# Altium schematic sheet Ch_VC.schdoc
size 403 x 215 mm
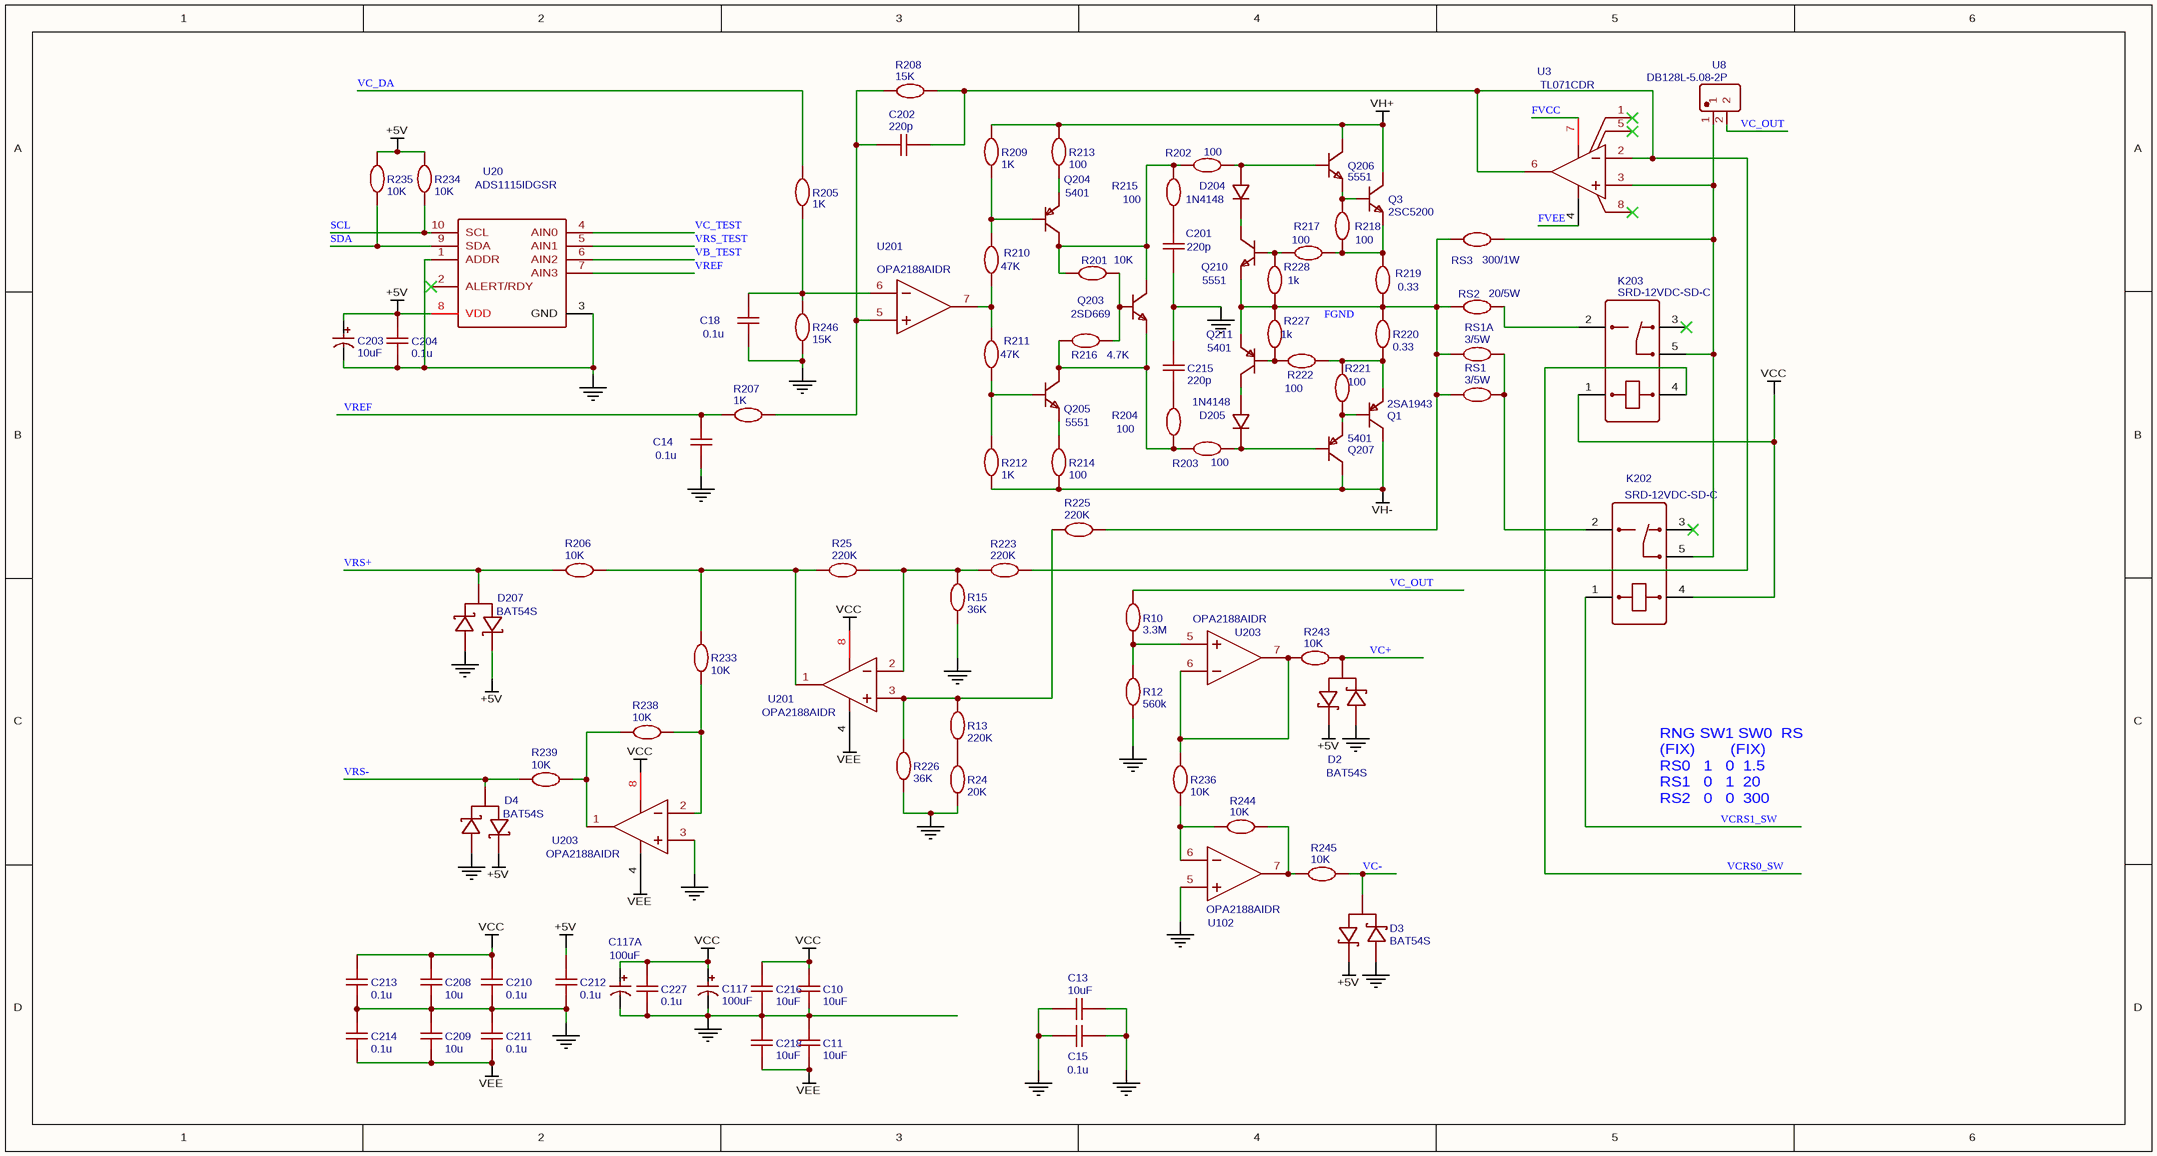
[diagram p0: Ch_VC.schdoc]

## Parts
(Parts that share a designator on the sheet are numbered #1, #2 ... from top to bottom, then left to right.)
C10  10uF  [C0805]
C11  10uF  [C0805]
C13  10uF  [C0805]
C14  0.1u  [C0805]
C15  0.1u  [C0805]
C18  0.1u  [C0805]
C117  100uF  [CAP-TH_BD8.0-P3.50-D1.0-FD]
C117A  100uF  [CAP-TH_BD8.0-P2.50-D1.0-FD]
C201  220p  [C0805]
C202  220p  [C0805]
C203  10uF  [C0805]
C204  0.1u  [C0805]
C208  10u  [C0805]
C209  10u  [C0805]
C210  0.1u  [C0805]
C211  0.1u  [C0805]
C212  0.1u  [C0805]
C213  0.1u  [C0805]
C214  0.1u  [C0805]
C215  220p  [C0805]
C216  10uF  [C0805]
C218  10uF  [C0805]
C227  0.1u  [C0805]
D2  BAT54S  [SOT-23(SOT-23-3)]
D3  BAT54S  [SOT-23(SOT-23-3)]
D4  BAT54S  [SOT-23(SOT-23-3)]
D204  1N4148  [SOD-123_L2.8-W1.8-LS3.7-RD]
D205  1N4148  [SOD-123_L2.8-W1.8-LS3.7-RD]
D207  BAT54S  [SOT-23(SOT-23-3)]
K202  SRD-12VDC-SD-C  [RELAY-SL-SRD]
K203  SRD-12VDC-SD-C  [RELAY-SL-SRD]
Q1  2SA1943  [TO-3PL_L20.0-W5.0-P5.45-L]
Q3  2SC5200  [TO-3PL_L20.0-W5.0-P5.45-L]
Q203  2SD669  [KO_TO126-ECB-V]
Q204  5401  [SOT-23-3_L2.9-W1.3-P1.90-LS2.4-BR]
Q205  5551  [SOT-23-3_L2.9-W1.3-P1.90-LS2.4-BR]
Q206  5551  [SOT-23-3_L2.9-W1.3-P1.90-LS2.4-BR]
Q207  5401  [SOT-23-3_L2.9-W1.3-P1.90-LS2.4-BR]
Q210  5551  [SOT-23-3_L2.9-W1.3-P1.90-LS2.4-BR]
Q211  5401  [SOT-23-3_L2.9-W1.3-P1.90-LS2.4-BR]
R10  3.3M  [R0805]
R12  560k  [R0805]
R13  220K  [R0805]
R15  36K  [R0805]
R24  20K  [R0805]
R25  220K  [R0805]
R201  10K  [R0805]
R202  100  [R0805]
R203  100  [R0805]
R204  100  [R0805]
R205  1K  [R0805]
R206  10K  [R0805]
R207  1K  [R0805]
R208  15K  [R0805]
R209  1K  [R0805]
R210  47K  [R0805]
R211  47K  [R0805]
R212  1K  [R0805]
R213  100  [R0805]
R214  100  [R0805]
R215  100  [R0805]
R216  4.7K  [R0805]
R217  100  [R0805]
R218  100  [R0805]
R219  0.33  [R-AXIAL-1.2- 5W]
R220  0.33  [R-AXIAL-1.2- 5W]
R221  100  [R0805]
R222  100  [R0805]
R223  220K  [R0805]
R225  220K  [R0805]
R226  36K  [R0805]
R227  1k  [R0805]
R228  1k  [R0805]
R233  10K  [R0805]
R234  10K  [R0805]
R235  10K  [R0805]
R236  10K  [R0805]
R238  10K  [R0805]
R239  10K  [R0805]
R243  10K  [R0805]
R244  10K  [R0805]
R245  10K  [R0805]
R246  15K  [R0805]
RS1  3/5W  [R_AXIAL-1.0]
RS1A  3/5W  [R_AXIAL-1.0]
RS2  20/5W  [R_AXIAL-1.0]
RS3  300/1W  [R_AXIAL-0.8]
U3  TL071CDR  [SOIC-8_L4.9-W3.9-P1.27-LS6.0-BL]
U8  DB128L-5.08-2P  [CONN-TH_2P-P5.08_DB128L-5.08-2P]
U20  ADS1115IDGSR  [MSOP-10]
U102  OPA2188AIDR  [SOIC-8_L4.9-W3.9-P1.27-LS6.0-BL]
U201#1  OPA2188AIDR  [SOIC-8_L4.9-W3.9-P1.27-LS6.0-BL]
U201#2  OPA2188AIDR  [SOIC-8_L4.9-W3.9-P1.27-LS6.0-BL]
U203#1  OPA2188AIDR  [SOIC-8_L4.9-W3.9-P1.27-LS6.0-BL]
U203#2  OPA2188AIDR  [SOIC-8_L4.9-W3.9-P1.27-LS6.0-BL]

## Nets
+5V: C203.1 C204.2 C212.2 D2.2(K2) D3.2(K2) D4.2(K2) D207.2(K2) R234.2 R235.2 U20.8(VDD)
GND: C10.1 C11.2 C13.1 C13.2 C14.1 C15.1 C15.2 C18.1 C117.2 C117A.2 C201.1 C203.2 C204.1 C208.1 C209.2 C210.1 C211.2 C212.1 C213.1 C214.2 C215.2 C216.1 C218.2 C227.1 D2.1(A1) D3.1(A1) D4.1(A1) D207.1(A1) R12.2 R15.2 R24.2 R226.2 R246.1 U20.1(ADDR) U20.3(GND) U102.5(IN_B+) U203#2.3(IN_A+)
VCC: C10.2 C117.1 C117A.1 C208.2 C210.2 C213.2 C216.2 C227.2 K202.4 K203.1 U201#2.8(V+) U203#2.8(V+)
VEE: C11.1 C209.1 C211.1 C214.1 C218.1 U201#2.4(V-) U203#2.4(V-)
VH+: Q3.2(C) Q206.3(C) R209.2 R213.2
VH-: Q1.2(C) Q207.3(C) R212.1 R214.1
FGND: Q210.2(E) Q211.2(E) R219.1 R220.2 R225.1 R227.2 R228.1 RS1.2 RS1A.2 RS2.1 RS3.1
FVCC: U3.7(VCC+)
FVEE: U3.4(VCC-)
SCL: R234.1 U20.10(SCL)
SDA: R235.1 U20.9(SDA)
VB_TEST: U20.6(AIN2)
VC+: D2.3(A) R243.1
VC-: D3.3(A) R245.1
VC_DA: R205.1
VC_OUT: R10.2 U8.2
VC_TEST: U20.4(AIN0)
VCRS0_SW: K203.4
VCRS1_SW: K202.1
VREF: C14.2 R207.1 U20.7(AIN3)
VRS+: D207.3(A) R206.1
VRS-: D4.3(A) R239.2
VRS_TEST: U20.5(AIN1)
NetC18_2: C18.2 R205.2 R246.2 U201#1.6(IN_B-)
NetC201_2: C201.2 R215.2
NetC202_1: C202.1 R207.2 R208.1 U201#1.5(IN_B+)
NetC202_2: C202.2 R208.2 R223.1 U3.2(IN-) U3.6(OUT)
NetC215_1: C215.1 R204.1
NetD204_1: D204.1(C) Q210.3(C)
NetD204_2: D204.2(A) Q206.1(B) R202.2
NetD205_1: D205.1(C) Q207.1(B) R203.2
NetD205_2: D205.2(A) Q211.3(C)
NetK202_2: K202.2 RS1.1 RS1A.1
NetK202_5: K202.5 K203.5 RS3.2 U3.3(IN+) U8.1
NetK203_2: K203.2 RS2.2
NetQ1_1: Q1.1(B) Q207.2(E) R221.1
NetQ1_3: Q1.3(E) R220.1 R221.2 R222.2
NetQ3_1: Q3.1(B) Q206.2(E) R218.2
NetQ3_3: Q3.3(E) R217.2 R218.1 R219.2
NetQ203_1: Q203.1(E) Q205.3(C) R203.1 R204.2 R216.1
NetQ203_2: Q203.2(B) R201.1 R216.2
NetQ203_3: Q203.3(C) Q204.3(C) R201.2 R202.1 R215.1
NetQ204_1: Q204.1(B) R209.1 R210.2
NetQ204_2: Q204.2(E) R213.1
NetQ205_1: Q205.1(B) R211.1 R212.2
NetQ205_2: Q205.2(E) R214.2
NetQ210_1: Q210.1(B) R217.1 R228.2
NetQ211_1: Q211.1(B) R222.1 R227.1
NetR10_1: R10.1 R12.1 U203#1.5(IN_B+)
NetR13_1: R13.1 R225.2 R226.1 U201#2.3(IN_A+)
NetR13_2: R13.2 R24.1
NetR15_1: R15.1 R25.2 R223.2 U201#2.2(IN_A-)
NetR25_1: R25.1 R206.2 R233.1 U201#2.1(OUT_A)
NetR210_1: R210.1 R211.2 U201#1.7(OUT_B)
NetR233_2: R233.2 R238.1 U203#2.2(IN_A-)
NetR236_1: R236.1 R244.2 U102.6(IN_B-)
NetR236_2: R236.2 R243.2 U203#1.6(IN_B-) U203#1.7(OUT_B)
NetR238_2: R238.2 R239.1 U203#2.1(OUT_A)
NetR244_1: R244.1 R245.2 U102.7(OUT_B)

Not connected (* = marked no-connect by the designer): K202 3*; K203 3*; U3 1(OFFSET_N1)* 5(OFFSET_N2)* 8(NC)*; U20 2(ALERT/RDY)*

## Notes on the sheet
- RNG SW1 SW0  RS
  (FIX)        (FIX)
  RS0   1   0  1.5
  RS1   0   1  20
  RS2   0   0  300

## Library data of the parts
C10 C11 C13 C216 C218 = 10uF: nameAlias: Value(F); spicePre: C; spiceSymbolName: Cap_0805_US
C14 C15 C18 C204 C210-C214 C227 = 0.1u: nameAlias: Value(F); spicePre: C; spiceSymbolName: Cap_0805_US
C117 C117A = 100uF: BOM_Manufacturer: ValuePro; BOM_Manufacturer Part: 100uF 16V 6.3*5; nameAlias: Capacitance; BOM_Supplier: LCSC; BOM_Supplier Part: C43804; spicePre: C; spiceSymbolName: 100uF 16V 6.3*5
C201 C202 C215 = 220p: nameAlias: Value(F); spicePre: C; spiceSymbolName: Cap_0805_US
C203 = 10uF: BOM_Manufacturer: ValuePro; BOM_Manufacturer Part: 10uF 16V 3*5; nameAlias: Capacitance; BOM_Supplier: LCSC; BOM_Supplier Part: C43798; spicePre: C; spiceSymbolName: 10uF 16V 3*5
C208 C209 = 10u: nameAlias: Value(F); spicePre: C; spiceSymbolName: Cap_0805_US
D2-D4 D207 = BAT54S: BOM_Manufacturer: SEMTECH; SMT Type: Extend; BOM_Supplier: LCSC; BOM_Manufacturer Part: BAT54S; image: //image.lceda.cn/szlcsc/C83935.jpg; BOM_Supplier Part: C83935; BOM_LCSC Assembly: Yes; spicePre: D
D204 D205 = 1N4148: BOM_Manufacturer: Galaxy; BOM_Manufacturer Part: 1N4148W; Contributor: LCSC; BOM_Supplier: LCSC; BOM_Supplier Part: C380927; spicePre: D; spiceSymbolName: 1N4148WG
K202 K203 = SRD-12VDC-SD-C: BOM_Manufacturer: Ningbo Songle Relay; Contributor: LCSC; BOM_Supplier: LCSC; BOM_Supplier Part: C247843; BOM_Manufacturer Part: SRD-12VDC-SD-C; spicePre: K
Q1 = 2SA1943: BOM_Manufacturer: SPTECH; Contributor: LCSC; BOM_Supplier: LCSC; BOM_Supplier Part: C480004; BOM_Manufacturer Part: 2SA1943; BOM_JLCPCB Part Class: Extended Part; spicePre: Q; spiceSymbolName: 2SA1943
Q3 = 2SC5200: BOM_Manufacturer: SPTECH; Contributor: LCSC; BOM_Supplier: LCSC; BOM_Supplier Part: C480027; BOM_Manufacturer Part: 2SC5200; BOM_JLCPCB Part Class: Extended Part; spicePre: Q; spiceSymbolName: 2SC5200
Q203 = 2SD669: BOM_Manufacturer: LGE; BOM_Manufacturer Part: MMBT5550; Contributor: LCSC; BOM_Supplier: LCSC; BOM_Supplier Part: C193745; spicePre: Q
Q204 Q207 = 5401: BOM_Manufacturer Part: MMBT5401; BOM_Manufacturer: Yangzhou Yangjie Elec Tech; Contributor: LCSC; BOM_Supplier: LCSC; BOM_Supplier Part: C405310; spicePre: Q
Q205 Q206 Q210 = 5551: BOM_Manufacturer: LGE; BOM_Manufacturer Part: MMBT5550; Contributor: LCSC; BOM_Supplier: LCSC; BOM_Supplier Part: C193745; spicePre: Q
Q211 = 5401: BOM_Manufacturer: Yangzhou Yangjie Elec Tech; BOM_Manufacturer Part: MMBT5401; Contributor: LCSC; BOM_Supplier: LCSC; BOM_Supplier Part: C405310; spicePre: Q
R10 = 3.3M: nameAlias: Value(Ω); spicePre: R; spiceSymbolName: Res_0805(1/8W)_EU
R12 = 560k: nameAlias: Value(Ω); spicePre: R; spiceSymbolName: Res_0805(1/8W)_EU
R13 R25 R223 R225 = 220K: nameAlias: Value(Ω); spicePre: R; spiceSymbolName: Res_0805(1/8W)_EU
R15 R226 = 36K: nameAlias: Value(Ω); spicePre: R; spiceSymbolName: Res_0805(1/8W)_EU
R24 = 20K: nameAlias: Value(Ω); spicePre: R; spiceSymbolName: Res_0805(1/8W)_EU
R201 R206 R233-R236 R238 R239 R243-R245 = 10K: nameAlias: Value(Ω); spicePre: R; spiceSymbolName: Res_0805(1/8W)_EU
R202-R204 R213-R215 R217 R218 R221 R222 = 100: nameAlias: Value(Ω); spicePre: R; spiceSymbolName: Res_0805(1/8W)_EU
R205 R207 R209 R212 = 1K: nameAlias: Value(Ω); spicePre: R; spiceSymbolName: Res_0805(1/8W)_EU
  R209: BOM_Supplier: LCSC
R208 R246 = 15K: nameAlias: Value(Ω); spicePre: R; spiceSymbolName: Res_0805(1/8W)_EU
R210 R211 = 47K: nameAlias: Value(Ω); spicePre: R; spiceSymbolName: Res_0805(1/8W)_EU
R216 = 4.7K: nameAlias: Value(Ω); spicePre: R; spiceSymbolName: Res_0805(1/8W)_EU
R219 R220 = 0.33: nameAlias: Value(Ω); spicePre: R; spiceSymbolName: Res_0805(1/8W)_EU
R227 R228 = 1k: nameAlias: Value(Ω); spicePre: R; spiceSymbolName: Res_0805(1/8W)_EU
RS1 RS1A = 3/5W: nameAlias: Value(Ω); spicePre: R; spiceSymbolName: Res_AXIAL-0.6(1W)_EU
RS2 = 20/5W: nameAlias: Value(Ω); spicePre: R; spiceSymbolName: Res_AXIAL-0.6(1W)_EU
RS3 = 300/1W: nameAlias: Value(Ω); spicePre: R; spiceSymbolName: Res_AXIAL-0.6(1W)_EU
U3 = TL071CDR: BOM_Manufacturer: TI; BOM_Supplier: LCSC; BOM_Manufacturer Part: TL071CDR; BOM_Supplier Part: C14449; BOM_JLCPCB Part Class: Extended Part; spicePre: U; spiceSymbolName: TL071CDR
U8 = DB128L-5.08-2P: BOM_Manufacturer: DIBO; Contributor: LCSC; BOM_Supplier: LCSC; BOM_Supplier Part: C395868; BOM_Manufacturer Part: DB128L-5.08-2P; spicePre: U; spiceSymbolName: DB128L-5.08-2P
U20 = ADS1115IDGSR: BOM_Manufacturer: TI; SMT Type: Extend; BOM_Supplier: LCSC; BOM_Manufacturer Part: ADS1115IDGSR; image: //image.lceda.cn/szlcsc/C37593.jpg; BOM_Supplier Part: C37593; BOM_LCSC Assembly: Yes; spicePre: U
U102 = OPA2188AIDR: BOM_Manufacturer: TI; subpart_no: 2; tags: Precision Operational Amplifier; BOM_Supplier Part: C17271; BOM_Supplier: LCSC; BOM_Manufacturer Part: OPA2188AIDR; image: http://image.lceda.cn/szlcsc/C17271.jpg; spicePre: U; spiceSymbolName: OPA2188AIDR
U201#1 U201#2 U203#1 U203#2 = OPA2188AIDR: BOM_Manufacturer: TI; subpart_no: 1; tags: Precision Operational Amplifier; BOM_Supplier Part: C17271; BOM_Supplier: LCSC; BOM_Manufacturer Part: OPA2188AIDR; image: http://image.lceda.cn/szlcsc/C17271.jpg; spicePre: U; spiceSymbolName: OPA2188AIDR